# Altium schematic sheet spi can controller.SchDoc
size A4
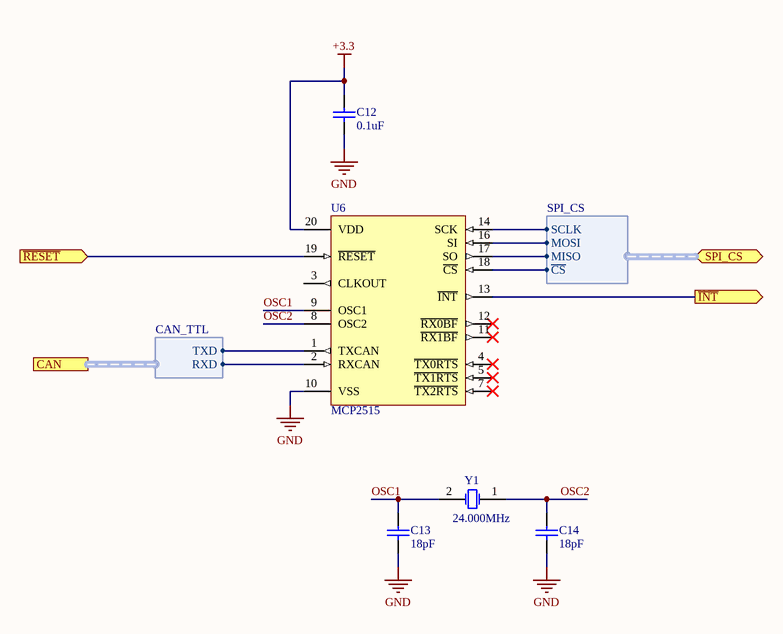
[diagram p0: spi can controller.SchDoc]

## Parts
C12  value 0.1uF  [C0603]  (hidden comment: Cap)
C13  value 18pF  [C0603]  (hidden comment: Cap)
C14  value 18pF  [C0603]  (hidden comment: Cap)
U6  MCP2515  [MCP2515]
Y1  value 24.000MHz  [C3E-24.000-12-3030-X]  (hidden comment: XTAL)

## Ports
CAN (harness CAN_TTL), SPI_CS (harness SPI_CS), ~{INT} (out), ~{RESET} (in)

## Harnesses
SPI_CS: ~{CS}, MISO, MOSI, SCLK
CAN_TTL: RXD, TXD

## Nets
+3.3: C12.1 U6.20(VDD)
GND: C12.2 C13.2 C14.2 U6.10(VSS)
~{INT}: U6.13(~{INT}) ; port ~{INT}
OSC1: C13.1 U6.9(OSC1) Y1.2(OSC2)
OSC2: C14.1 U6.8(OSC2) Y1.1(OSC1)
~{RESET}: U6.19(~{RESET}) ; port ~{RESET}
NetU6_1: U6.1(TXCAN) ; port CAN.TXD
NetU6_2: U6.2(RXCAN) ; port CAN.RXD
NetU6_14: U6.14(SCK) ; port SPI_CS.SCLK
NetU6_16: U6.16(SI) ; port SPI_CS.MOSI
NetU6_17: U6.17(SO) ; port SPI_CS.MISO
NetU6_18: U6.18(~{CS}) ; port SPI_CS.~{CS}

Not connected (* = marked no-connect by the designer): U6 3(CLKOUT) 4(~{TX0RTS})* 5(~{TX1RTS})* 7(~{TX2RTS})* 11(~{RX1BF})* 12(~{RX0BF})*

## Library data of the parts
C12-C14 = Cap: Capacitor
  C12: farnell: 9406140
  C13 C14: farnell: 1759056
U6 = MCP2515: MICROCHIP - MCP2515-I/ST - CAN CONTROLLER, SMD, 2515, TSSOP20; farnell: 1196851
Y1 = XTAL: Crystal Oscillator; farnell: 1538861